# Altium schematic sheet DM3390_TopLevel.SchDoc: =project_title
size Tabloid; PageSetup: Record=PageOptions|CenterHorizontal=True|CenterVertical=True|PrintScale=0.73|XCorrection=1.00|YCorrection=1.00|PrintKind=0|BorderSize=5000000|LeftOffset=0|BottomOffset=0|Orientation=2|PaperLength=1000|PaperWidth=1000|Scale=100|PaperSource=7|PrintQuality=-4|MediaType=1|DitherType=10|PaperKind=A4|PrintScaleMode=1; CompanyName: Luxonis Holding; Organization: Luxonis Holding; Address1: 1925 Harmony Park Drive; Address2: Westminster, CO; Address3: 80234; Address4: United States; SheetNumber: 1; SheetTotal: 12
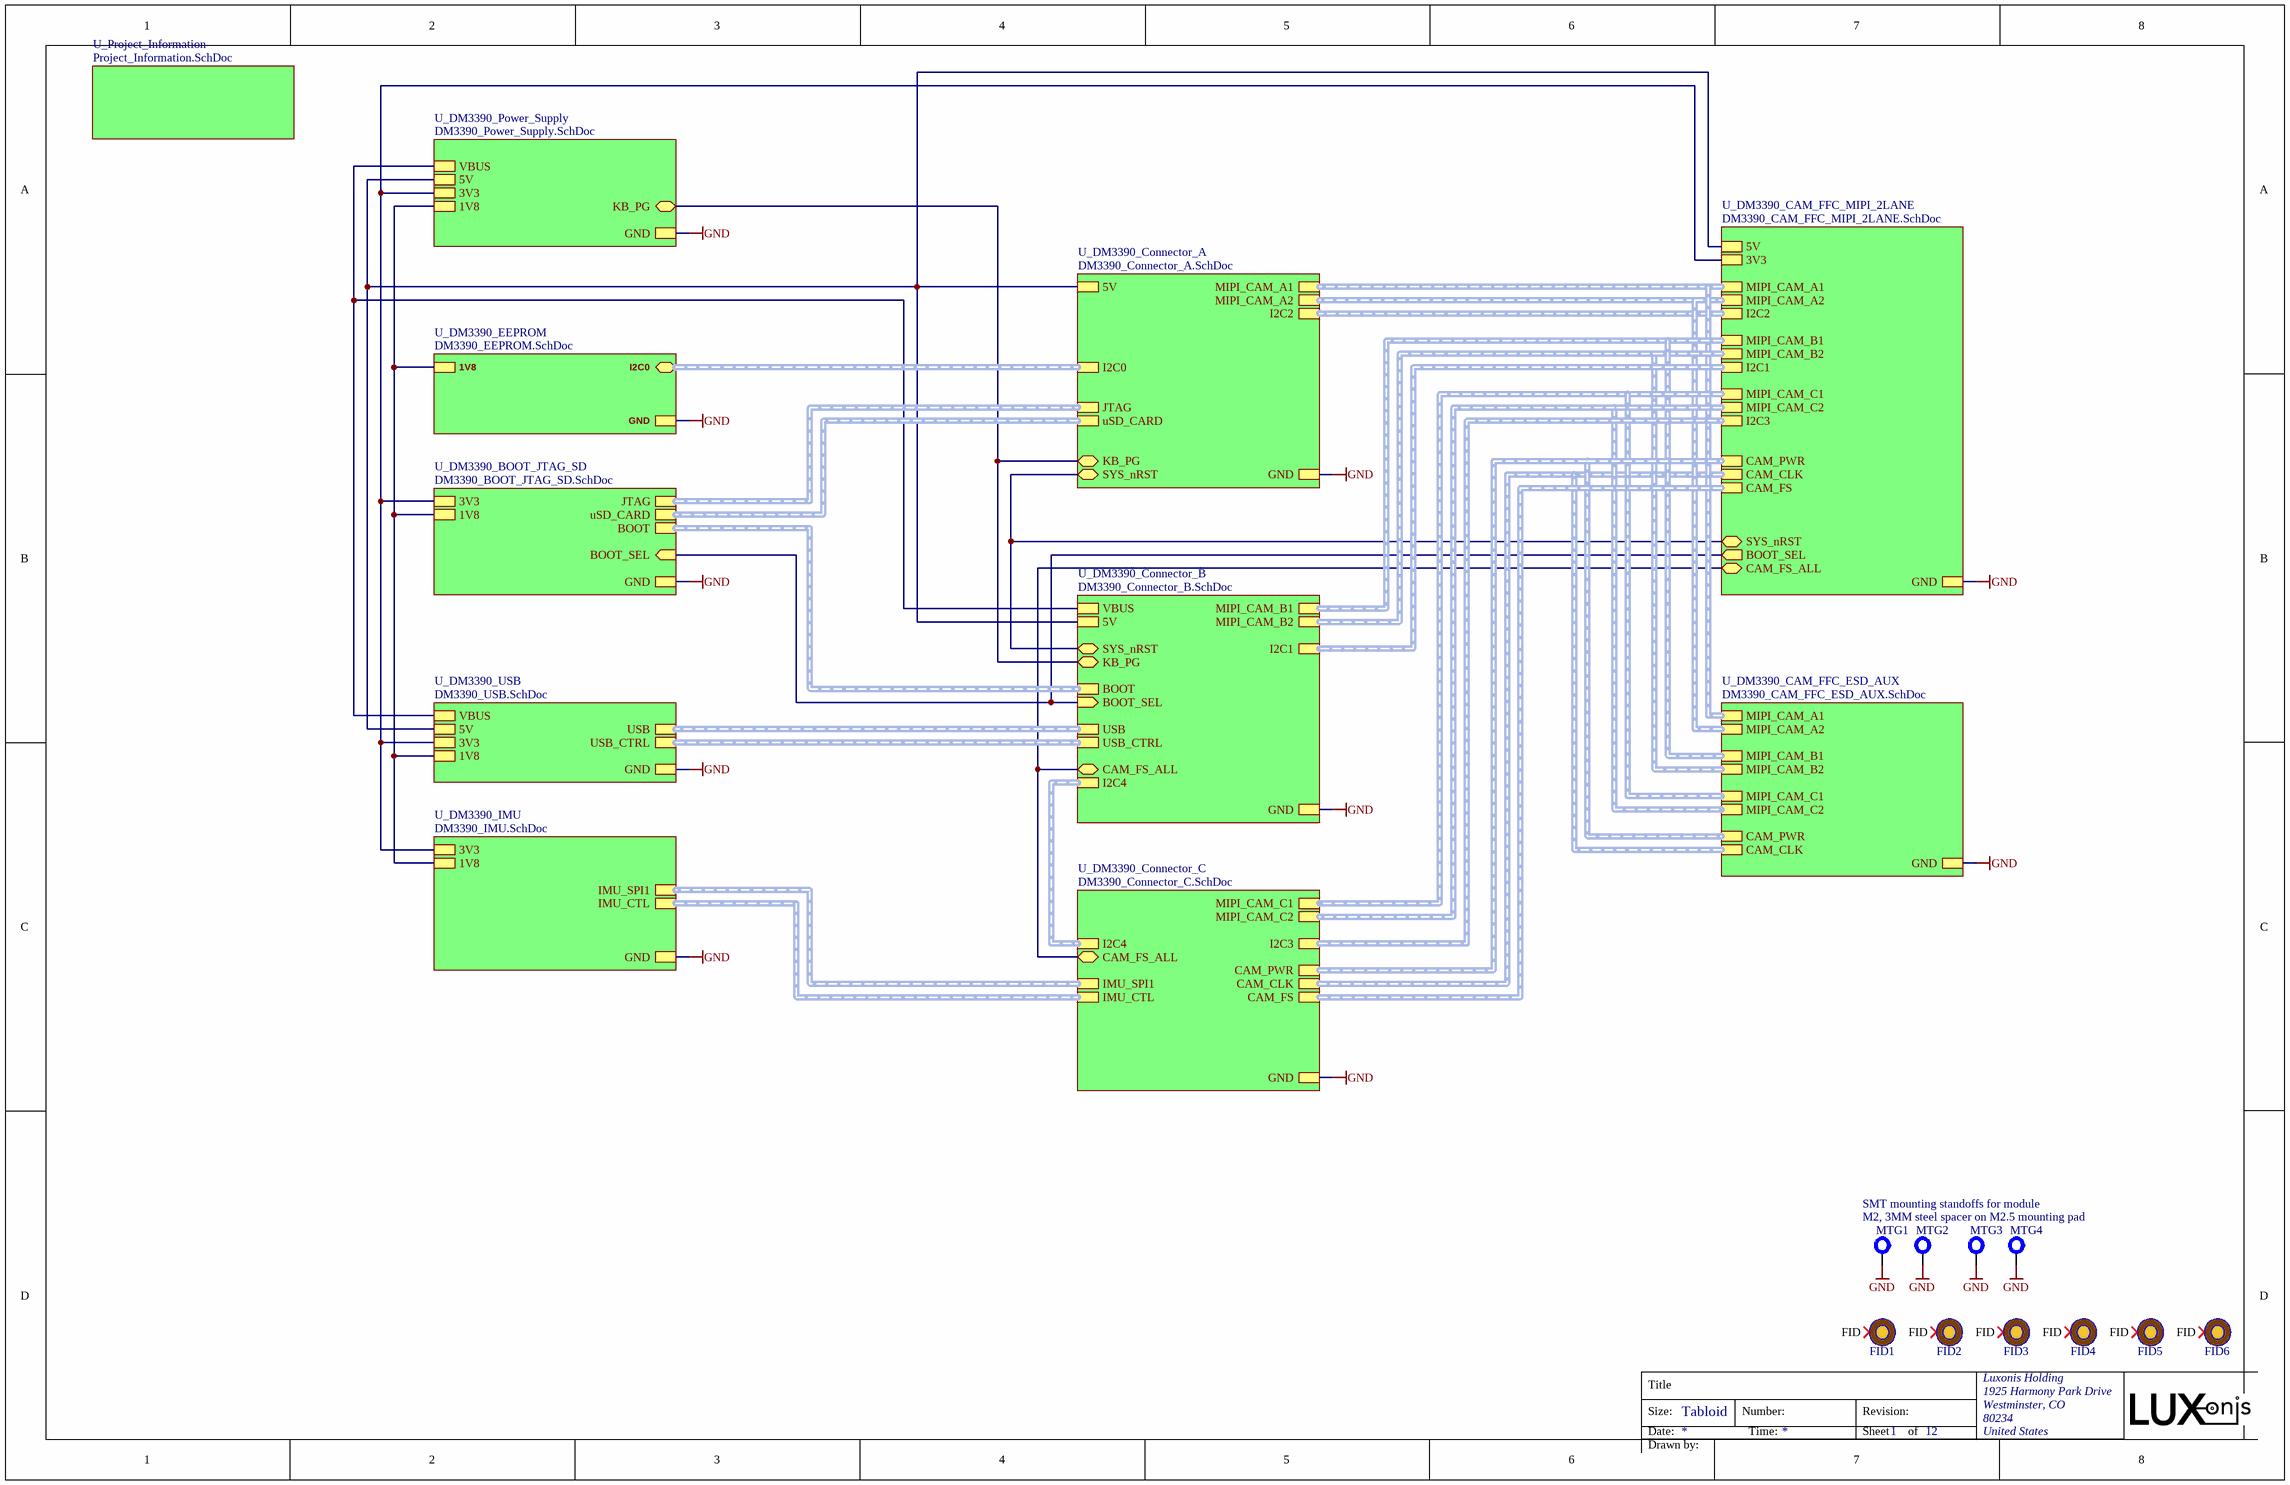
[diagram p0: DM3390_TopLevel.SchDoc]

## Parts
FID1  FIDUCIAL_ROUND_1MM  [FIDUCIAL_ROUND_1MM]  (value not drawn)  (no BOM)
FID2  FIDUCIAL_ROUND_1MM  [FIDUCIAL_ROUND_1MM]  (value not drawn)  (no BOM)
FID3  FIDUCIAL_ROUND_1MM  [FIDUCIAL_ROUND_1MM]  (value not drawn)  (no BOM)
FID4  FIDUCIAL_ROUND_1MM  [FIDUCIAL_ROUND_1MM]  (value not drawn)  (no BOM)
FID5  FIDUCIAL_ROUND_1MM  [FIDUCIAL_ROUND_1MM]  (value not drawn)  (no BOM)
FID6  FIDUCIAL_ROUND_1MM  [FIDUCIAL_ROUND_1MM]  (value not drawn)  (no BOM)
MTG1  M2, 3MM steel spacer on M2.5 mounting pad  [9774030243R]
MTG2  M2, 3MM steel spacer on M2.5 mounting pad  [9774030243R]  (value not drawn)
MTG3  M2, 3MM steel spacer on M2.5 mounting pad  [9774030243R]  (value not drawn)
MTG4  M2, 3MM steel spacer on M2.5 mounting pad  [9774030243R]  (value not drawn)

## Sub-sheets
U_DM3390_BOOT_JTAG_SD = DM3390_BOOT_JTAG_SD.SchDoc: 1V8, GND, 3V3, JTAG (harness JTAG), BOOT (harness BOOT), uSD_CARD (harness uSD_CARD), BOOT_SEL (in)
U_DM3390_CAM_FFC_ESD_AUX = DM3390_CAM_FFC_ESD_AUX.SchDoc: MIPI_CAM_C1 (harness MIPI_CAM_C1), MIPI_CAM_C2 (harness MIPI_CAM_C2), MIPI_CAM_B1 (harness MIPI_CAM_B1), MIPI_CAM_A1 (harness MIPI_CAM_A1), MIPI_CAM_A2 (harness MIPI_CAM_A2), CAM_PWR (harness CAM_PWR), MIPI_CAM_B2 (harness MIPI_CAM_B2), CAM_CLK (harness CAM_CLK), GND
U_DM3390_CAM_FFC_MIPI_2LANE = DM3390_CAM_FFC_MIPI_2LANE.SchDoc: I2C1 (harness I2C1), GND, 3V3, CAM_FS_ALL (bidir), MIPI_CAM_C1 (harness MIPI_CAM_C1), MIPI_CAM_C2 (harness MIPI_CAM_C2), I2C3 (harness I2C3), MIPI_CAM_B2 (harness MIPI_CAM_B2), MIPI_CAM_B1 (harness MIPI_CAM_B1), CAM_CLK (harness CAM_CLK), CAM_PWR (harness CAM_PWR), MIPI_CAM_A2 (harness MIPI_CAM_A2), MIPI_CAM_A1 (harness MIPI_CAM_A1), I2C2 (harness I2C2), CAM_FS (harness CAM_FS), SYS_nRST (bidir), BOOT_SEL (out), 5V
U_DM3390_Connector_A = DM3390_Connector_A.SchDoc: 5V, GND, MIPI_CAM_A1 (harness MIPI_CAM_A1), MIPI_CAM_A2 (harness MIPI_CAM_A2), I2C0 (harness I2C0), JTAG (harness JTAG), I2C2 (harness I2C2), KB_PG (bidir), uSD_CARD (harness uSD_CARD), SYS_nRST (bidir)
U_DM3390_Connector_B = DM3390_Connector_B.SchDoc: MIPI_CAM_B2 (harness MIPI_CAM_B2), GND, MIPI_CAM_B1 (harness MIPI_CAM_B1), USB (harness USB), I2C4 (harness I2C4), CAM_FS_ALL (bidir), I2C1 (harness I2C1), BOOT_SEL (in), KB_PG (bidir), USB_CTRL (harness USB_CTRL), SYS_nRST (bidir), BOOT, VBUS, 5V
U_DM3390_Connector_C = DM3390_Connector_C.SchDoc: MIPI_CAM_C1 (harness MIPI_CAM_C1), GND, MIPI_CAM_C2 (harness MIPI_CAM_C2), I2C4 (harness I2C4), IMU_SPI1 (harness IMU_SPI1), CAM_PWR (harness CAM_PWR), CAM_CLK (harness CAM_CLK), CAM_FS (harness CAM_FS), CAM_FS_ALL (bidir), IMU_CTL (harness IMU_CTL), I2C3 (harness I2C3)
U_DM3390_EEPROM = DM3390_EEPROM.SchDoc: 1V8, GND, I2C0 (bidir, harness I2C0)
U_DM3390_IMU = DM3390_IMU.SchDoc: GND, 3V3, 1V8, IMU_SPI1 (harness IMU_SPI1), IMU_CTL (harness IMU_CTL)
U_DM3390_Power_Supply = DM3390_Power_Supply.SchDoc: GND, 1V8, 5V, VBUS, 3V3, KB_PG (bidir)
U_DM3390_USB = DM3390_USB.SchDoc: VBUS, GND, 3V3, 5V, USB (harness USB), USB_CTRL (harness USB_CTRL), 1V8
U_Project_Information = Project_Information.SchDoc: no entries

## Nets
GND: MTG1.1 MTG2.1 MTG3.1 MTG4.1 ; sheet U_DM3390_USB/GND, sheet U_DM3390_Power_Supply/GND, sheet U_DM3390_IMU/GND, sheet U_DM3390_BOOT_JTAG_SD/GND, sheet U_DM3390_CAM_FFC_ESD_AUX/GND, sheet U_DM3390_CAM_FFC_MIPI_2LANE/GND, sheet U_DM3390_Connector_A/GND, sheet U_DM3390_Connector_B/GND, sheet U_DM3390_EEPROM/GND, sheet U_DM3390_Connector_C/GND
(unnamed): sheet U_DM3390_USB/VBUS, sheet U_DM3390_Power_Supply/VBUS, sheet U_DM3390_Connector_B/VBUS
(unnamed): sheet U_DM3390_USB/3V3, sheet U_DM3390_Power_Supply/3V3, sheet U_DM3390_IMU/3V3, sheet U_DM3390_BOOT_JTAG_SD/3V3, sheet U_DM3390_CAM_FFC_MIPI_2LANE/3V3
(unnamed): sheet U_DM3390_USB/5V, sheet U_DM3390_Power_Supply/5V, sheet U_DM3390_CAM_FFC_MIPI_2LANE/5V, sheet U_DM3390_Connector_A/5V, sheet U_DM3390_Connector_B/5V
(unnamed): sheet U_DM3390_USB/1V8, sheet U_DM3390_Power_Supply/1V8, sheet U_DM3390_IMU/1V8, sheet U_DM3390_BOOT_JTAG_SD/1V8, sheet U_DM3390_EEPROM/1V8
(unnamed): sheet U_DM3390_Power_Supply/KB_PG, sheet U_DM3390_Connector_A/KB_PG, sheet U_DM3390_Connector_B/KB_PG
(unnamed): sheet U_DM3390_BOOT_JTAG_SD/BOOT_SEL, sheet U_DM3390_CAM_FFC_MIPI_2LANE/BOOT_SEL, sheet U_DM3390_Connector_B/BOOT_SEL
(unnamed): sheet U_DM3390_CAM_FFC_MIPI_2LANE/CAM_FS_ALL, sheet U_DM3390_Connector_B/CAM_FS_ALL, sheet U_DM3390_Connector_C/CAM_FS_ALL
(unnamed): sheet U_DM3390_CAM_FFC_MIPI_2LANE/SYS_nRST, sheet U_DM3390_Connector_A/SYS_nRST, sheet U_DM3390_Connector_B/SYS_nRST

Not connected (* = marked no-connect by the designer): FID1 FID*; FID2 FID*; FID3 FID*; FID4 FID*; FID5 FID*; FID6 FID*

## Buses and harness runs
harness sheet U_DM3390_BOOT_JTAG_SD/BOOT = sheet U_DM3390_Connector_B/BOOT
harness sheet U_DM3390_BOOT_JTAG_SD/JTAG = sheet U_DM3390_Connector_A/JTAG
harness sheet U_DM3390_BOOT_JTAG_SD/uSD_CARD = sheet U_DM3390_Connector_A/uSD_CARD
harness sheet U_DM3390_CAM_FFC_ESD_AUX/CAM_CLK = sheet U_DM3390_CAM_FFC_MIPI_2LANE/CAM_CLK = sheet U_DM3390_Connector_C/CAM_CLK
harness sheet U_DM3390_CAM_FFC_ESD_AUX/CAM_PWR = sheet U_DM3390_CAM_FFC_MIPI_2LANE/CAM_PWR = sheet U_DM3390_Connector_C/CAM_PWR
harness sheet U_DM3390_CAM_FFC_ESD_AUX/MIPI_CAM_A1 = sheet U_DM3390_CAM_FFC_MIPI_2LANE/MIPI_CAM_A1 = sheet U_DM3390_Connector_A/MIPI_CAM_A1
harness sheet U_DM3390_CAM_FFC_ESD_AUX/MIPI_CAM_A2 = sheet U_DM3390_CAM_FFC_MIPI_2LANE/MIPI_CAM_A2 = sheet U_DM3390_Connector_A/MIPI_CAM_A2
harness sheet U_DM3390_CAM_FFC_ESD_AUX/MIPI_CAM_B1 = sheet U_DM3390_CAM_FFC_MIPI_2LANE/MIPI_CAM_B1 = sheet U_DM3390_Connector_B/MIPI_CAM_B1
harness sheet U_DM3390_CAM_FFC_ESD_AUX/MIPI_CAM_B2 = sheet U_DM3390_CAM_FFC_MIPI_2LANE/MIPI_CAM_B2 = sheet U_DM3390_Connector_B/MIPI_CAM_B2
harness sheet U_DM3390_CAM_FFC_ESD_AUX/MIPI_CAM_C1 = sheet U_DM3390_CAM_FFC_MIPI_2LANE/MIPI_CAM_C1 = sheet U_DM3390_Connector_C/MIPI_CAM_C1
harness sheet U_DM3390_CAM_FFC_ESD_AUX/MIPI_CAM_C2 = sheet U_DM3390_CAM_FFC_MIPI_2LANE/MIPI_CAM_C2 = sheet U_DM3390_Connector_C/MIPI_CAM_C2
harness sheet U_DM3390_CAM_FFC_MIPI_2LANE/CAM_FS = sheet U_DM3390_Connector_C/CAM_FS
harness sheet U_DM3390_CAM_FFC_MIPI_2LANE/I2C1 = sheet U_DM3390_Connector_B/I2C1
harness sheet U_DM3390_CAM_FFC_MIPI_2LANE/I2C2 = sheet U_DM3390_Connector_A/I2C2
harness sheet U_DM3390_CAM_FFC_MIPI_2LANE/I2C3 = sheet U_DM3390_Connector_C/I2C3
harness sheet U_DM3390_Connector_A/I2C0 = sheet U_DM3390_EEPROM/I2C0
harness sheet U_DM3390_Connector_B/I2C4 = sheet U_DM3390_Connector_C/I2C4
harness sheet U_DM3390_Connector_B/USB = sheet U_DM3390_USB/USB
harness sheet U_DM3390_Connector_B/USB_CTRL = sheet U_DM3390_USB/USB_CTRL
harness sheet U_DM3390_Connector_C/IMU_CTL = sheet U_DM3390_IMU/IMU_CTL
harness sheet U_DM3390_Connector_C/IMU_SPI1 = sheet U_DM3390_IMU/IMU_SPI1

## Notes on the sheet
- SMT mounting standoffs for module
- Title
- Size:
- Date:
- Tabloid
- Number:
- Time:
- Revision:
- Sheet
- of
- Drawn by:

## Library data of the parts
FID1-FID6 = FIDUCIAL: Fiducial with various available footprints
MTG1-MTG4 = 9774030243R: MP ROUND STANDOFF M2X0.4 STEEL 3MM; Manufacturer 1: Wurth Electronics; Plating: Tin; Threaded/Unthreaded: Threaded; Outside Diameter: 0.171inch; Supplier 1: Digi-Key; Manufacturer Part Number 1: 9774030243R; Stock 1: 20568; Pricing 1: 1=0.95000, 10=0.91800, 50=0.79500, 100=0.73900 (USD); RoHS: Yes; Material: Steel; Length: 0.173inch; REACH SVHC: Unknown; ComponentLink1URL: http://www.mouser.com/ds/2/445/9774030243R-611455.pdf?src-supplier=Mouser; ComponentLink1Description: http://www.mouser.com/ds/2/445/9774030243R-611455.pdf?src-supplier=Mouser; ComponentLink2URL: http://www.farnell.com/datasheets/1960368.pdf?src-supplier=Farnell; ComponentLink2Description: http://www.farnell.com/datasheets/1960368.pdf?src-supplier=Farnell; ComponentLink3URL: https://katalog.we-online.de/em/datasheet/9774030243R.pdf?src-supplier=Digi-Key; ComponentLink3Description: https://katalog.we-online.de/em/datasheet/9774030243R.pdf?src-supplier=Digi-Key; ComponentLink4URL: http://www.farnell.com/datasheets/1960368.pdf?src-supplier=Newark; ComponentLink4Description: http://www.farnell.com/datasheets/1960368.pdf?src-supplier=Newark; ComponentLink5URL: http://www.farnell.com/datasheets/1960368.pdf?src-supplier=Element14; ComponentLink5Description: http://www.farnell.com/datasheets/1960368.pdf?src-supplier=Element14; Supplier Part Number 1: 732-7085-1-ND; Supplier 2: Mouser; Supplier Part Number 2: 710-9774030243R; Supplier 3: Element14; Supplier Part Number 3: 2497599